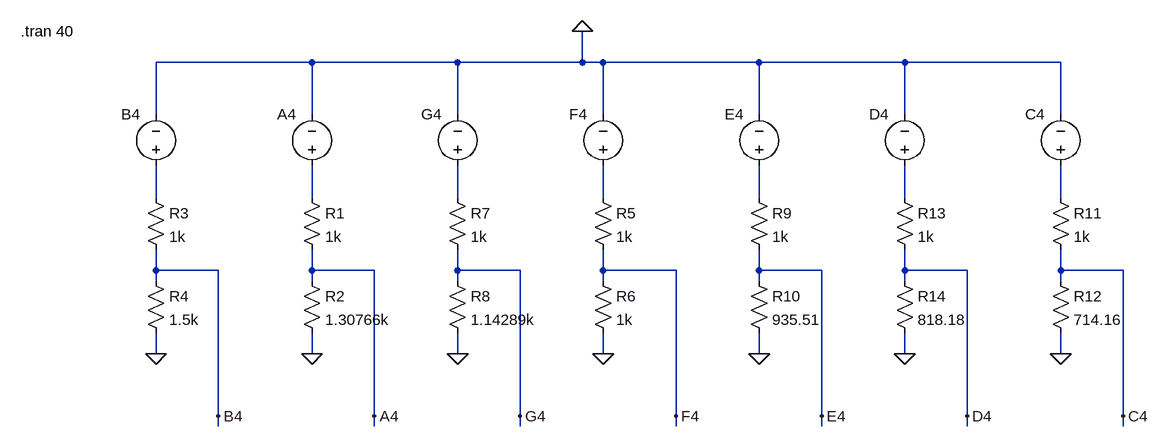
[diagram p0: schematic Key_Input.asc]
Key_Input.asc, the LTspice schematic file:
Version 4
SHEET 1 880 848
WIRE -800 48 -1040 48
WIRE -576 48 -800 48
WIRE -384 48 -384 0
WIRE -384 48 -576 48
WIRE -352 48 -384 48
WIRE -112 48 -352 48
WIRE 112 48 -112 48
WIRE 352 48 112 48
WIRE -1040 128 -1040 48
WIRE -800 128 -800 48
WIRE -576 128 -576 48
WIRE -352 128 -352 48
WIRE -112 128 -112 48
WIRE 112 128 112 48
WIRE 352 128 352 48
WIRE -1040 256 -1040 208
WIRE -800 256 -800 208
WIRE -576 256 -576 208
WIRE -352 256 -352 208
WIRE -112 256 -112 208
WIRE 112 256 112 208
WIRE 352 256 352 208
WIRE -1040 368 -1040 336
WIRE -944 368 -1040 368
WIRE -800 368 -800 336
WIRE -704 368 -800 368
WIRE -576 368 -576 336
WIRE -480 368 -576 368
WIRE -352 368 -352 336
WIRE -240 368 -352 368
WIRE -112 368 -112 336
WIRE -16 368 -112 368
WIRE 112 368 112 336
WIRE 208 368 112 368
WIRE 352 368 352 336
WIRE 448 368 352 368
WIRE -1040 384 -1040 368
WIRE -800 384 -800 368
WIRE -576 384 -576 368
WIRE -352 384 -352 368
WIRE -112 384 -112 368
WIRE 112 384 112 368
WIRE 352 384 352 368
WIRE -1040 496 -1040 464
WIRE -800 496 -800 464
WIRE -576 496 -576 464
WIRE -352 496 -352 464
WIRE -112 496 -112 464
WIRE 112 496 112 464
WIRE 352 496 352 464
WIRE -944 592 -944 368
WIRE -704 592 -704 368
WIRE -480 592 -480 368
WIRE -240 592 -240 368
WIRE -16 592 -16 368
WIRE 208 592 208 368
WIRE 448 592 448 368
WIRE -944 608 -944 592
WIRE -704 608 -704 592
WIRE -480 608 -480 592
WIRE -240 608 -240 592
WIRE -16 608 -16 592
WIRE 208 608 208 592
WIRE 448 608 448 592
FLAG -800 496 0
FLAG -1040 496 0
FLAG -352 496 0
FLAG -576 496 0
FLAG -112 496 0
FLAG 352 496 0
FLAG 112 496 0
FLAG -384 0 0
FLAG 448 592 C4
FLAG 208 592 D4
FLAG -16 592 E4
FLAG -240 592 F4
FLAG -480 592 G4
FLAG -704 592 A4
FLAG -944 592 B4
SYMBOL res -816 240 R0
SYMATTR InstName R1
SYMATTR Value 1k
SYMBOL res -816 368 R0
SYMATTR InstName R2
SYMATTR Value 1.30766k
SYMBOL res -1056 240 R0
SYMATTR InstName R3
SYMATTR Value 1k
SYMBOL res -1056 368 R0
SYMATTR InstName R4
SYMATTR Value 1.5k
SYMBOL res -368 240 R0
SYMATTR InstName R5
SYMATTR Value 1k
SYMBOL res -368 368 R0
SYMATTR InstName R6
SYMATTR Value 1k
SYMBOL res -592 240 R0
SYMATTR InstName R7
SYMATTR Value 1k
SYMBOL res -592 368 R0
SYMATTR InstName R8
SYMATTR Value 1.14289k
SYMBOL res -128 240 R0
SYMATTR InstName R9
SYMATTR Value 1k
SYMBOL res -128 368 R0
SYMATTR InstName R10
SYMATTR Value 935.51
SYMBOL res 336 240 R0
SYMATTR InstName R11
SYMATTR Value 1k
SYMBOL res 336 368 R0
SYMATTR InstName R12
SYMATTR Value 714.16
SYMBOL res 96 240 R0
SYMATTR InstName R13
SYMATTR Value 1k
SYMBOL res 96 368 R0
SYMATTR InstName R14
SYMATTR Value 818.18
SYMBOL voltage -1040 224 R180
WINDOW 0 24 96 Left 2
WINDOW 3 24 16 Invisible 2
WINDOW 123 0 0 Left 0
WINDOW 39 0 0 Left 0
SYMATTR InstName B4
SYMATTR Value PWL(29.999999999999 0 30 5 35 5 35.00000000001 0)
SYMBOL voltage -800 224 R180
WINDOW 0 24 96 Left 2
WINDOW 3 24 16 Invisible 2
WINDOW 123 0 0 Left 0
WINDOW 39 0 0 Left 0
SYMATTR InstName A4
SYMATTR Value PWL(24.99999999999999 0 25 5 30 5 30.00000000000001 0)
SYMBOL voltage -576 224 R180
WINDOW 0 24 96 Left 2
WINDOW 3 24 68 Invisible 2
WINDOW 123 0 0 Left 0
WINDOW 39 0 0 Left 0
SYMATTR InstName G4
SYMATTR Value PWL(19.9999999 0 20 5 25 5 25.0000000001 0)
SYMBOL voltage -352 224 R180
WINDOW 0 24 96 Left 2
WINDOW 3 24 68 Invisible 2
WINDOW 123 0 0 Left 0
WINDOW 39 0 0 Left 0
SYMATTR InstName F4
SYMATTR Value PWL(14.9999999 0 15 5 20 5 20.00000001 0)
SYMBOL voltage -112 224 R180
WINDOW 0 24 96 Left 2
WINDOW 3 24 68 Invisible 2
WINDOW 123 0 0 Left 0
WINDOW 39 0 0 Left 0
SYMATTR InstName E4
SYMATTR Value PWL(9.999999 0 10 5 15 5 15.00000001 0)
SYMBOL voltage 112 224 R180
WINDOW 0 24 96 Left 2
WINDOW 3 24 68 Invisible 2
WINDOW 123 0 0 Left 0
WINDOW 39 0 0 Left 0
SYMATTR InstName D4
SYMATTR Value PWL(4.99999 0 5 5 10 5 10.000001 0)
SYMBOL voltage 352 224 R180
WINDOW 0 24 96 Left 2
WINDOW 3 24 68 Invisible 2
WINDOW 123 0 0 Left 0
WINDOW 39 0 0 Left 0
SYMATTR InstName C4
SYMATTR Value PWL(0 5 5 5 5.00000001 0)
TEXT -1248 0 Left 2 !.tran 40

The netlist it stands for:
* Key_Input.asc
R1 N002 A4 1k
R2 A4 0 1.30766k
R3 N001 B4 1k
R4 B4 0 1.5k
R5 N004 F4 1k
R6 F4 0 1k
R7 N003 G4 1k
R8 G4 0 1.14289k
R9 N005 E4 1k
R10 E4 0 935.51
R11 N007 C4 1k
R12 C4 0 714.16
R13 N006 D4 1k
R14 D4 0 818.18
V§B4 N001 0 PWL(29.999999999999 0 30 5 35 5 35.00000000001 0)
V§A4 N002 0 PWL(24.99999999999999 0 25 5 30 5 30.00000000000001 0)
V§G4 N003 0 PWL(19.9999999 0 20 5 25 5 25.0000000001 0)
V§F4 N004 0 PWL(14.9999999 0 15 5 20 5 20.00000001 0)
V§E4 N005 0 PWL(9.999999 0 10 5 15 5 15.00000001 0)
V§D4 N006 0 PWL(4.99999 0 5 5 10 5 10.000001 0)
V§C4 N007 0 PWL(0 5 5 5 5.00000001 0)
.tran 40
.backanno
.end